# Altium project mag_pos_adapter.PrjPcb
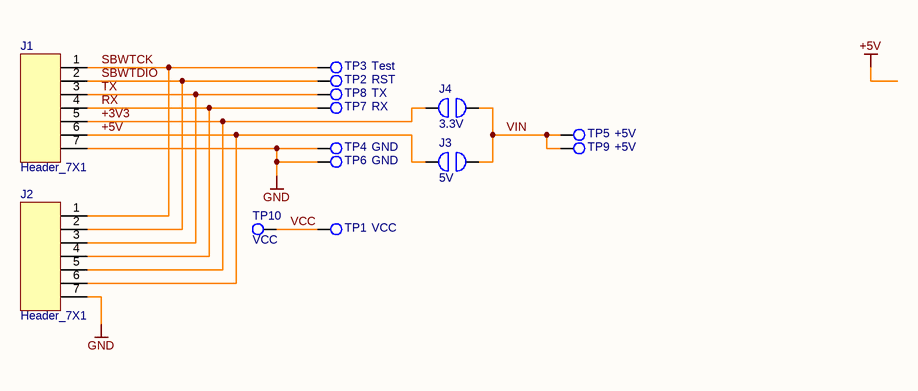
[diagram p0: mag_pos_adapter.SchDoc]
1 sheet, 14 parts. Net scope: global (net labels, ports and power ports of the same name join across sheets).
Board files: mag_pos_adapter.PcbDoc, mag_pos_adapter_guide.PcbDoc

## Sheet mag_pos_adapter.SchDoc
size A4

### Parts
J1  Header_7X1  [HDRV7W64P254_1X7_1778X254X800P]
J2  Header_7X1  [HDRV7W64P254_1X7_1778X254X800P]
J3  5V  [Solder_Jumper_2pin_0.2mm]
J4  3.3V  [Solder_Jumper_2pin_0.2mm]
TP1  VCC  [TP_SPRING_PROBE_1.7MM_2.5MM]
TP2  RST  [TP_SPRING_PROBE_1.7MM_2.5MM]
TP3  Test  [TP_SPRING_PROBE_1.7MM_2.5MM]
TP4  GND  [TP_SPRING_PROBE_1.7MM_2.5MM]
TP5  +5V  [TP_SPRING_PROBE_1.7MM_2.5MM]
TP6  GND  [TP_SPRING_PROBE_1.7MM_2.5MM]
TP7  RX  [TP_SPRING_PROBE_1.7MM_2.5MM]
TP8  TX  [TP_SPRING_PROBE_1.7MM_2.5MM]
TP9  +5V  [TP_SPRING_PROBE_1.7MM_2.5MM]
TP10  VCC  [TP_SMD_1MM]

### Nets
+5V: J1.6 J2.6 J3.1
GND: J1.7 J2.7 TP4.1 TP6.1
+3V3: J1.5 J2.5 J4.1
RX: J1.4 J2.4 TP7.1
SBWTCK: J1.1 J2.1 TP3.1
SBWTDIO: J1.2 J2.2 TP2.1
TX: J1.3 J2.3 TP8.1
VCC: TP1.1 TP10.1
VIN: J3.2 J4.2 TP5.1 TP9.1

### Library data of the parts
J1 J2 = Header_7X1: Header 7x1 pins
J3 J4 = SolderJumper_2
TP1-TP9 = TP_SPRING_PROBE_1.7MM: Spring probe sleeve 1.7mm hole diameter, 2.5mm pad size, Harwin S25-022; System: Connector
TP10 = TP_SMD_1mm: Testpoint SMD 1mm